# Altium schematic sheet Sheet1.SchDoc
size A2
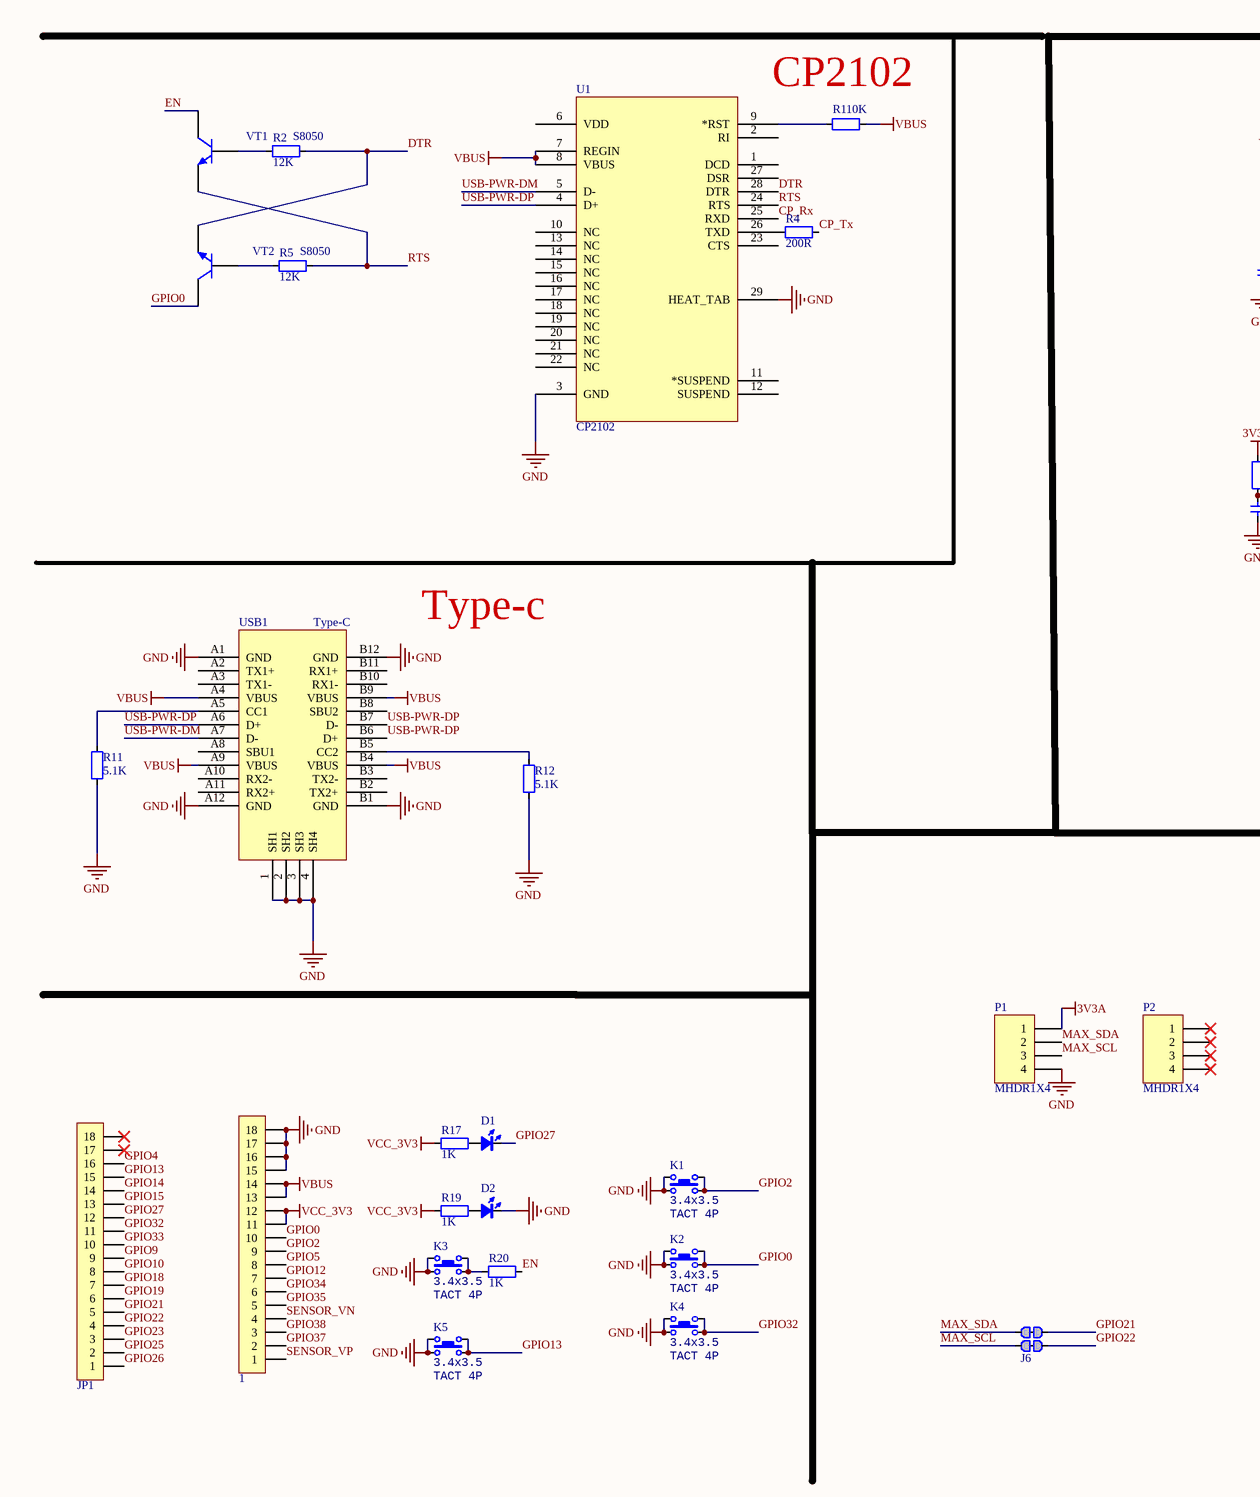
[diagram p0: Sheet1.SchDoc, left]
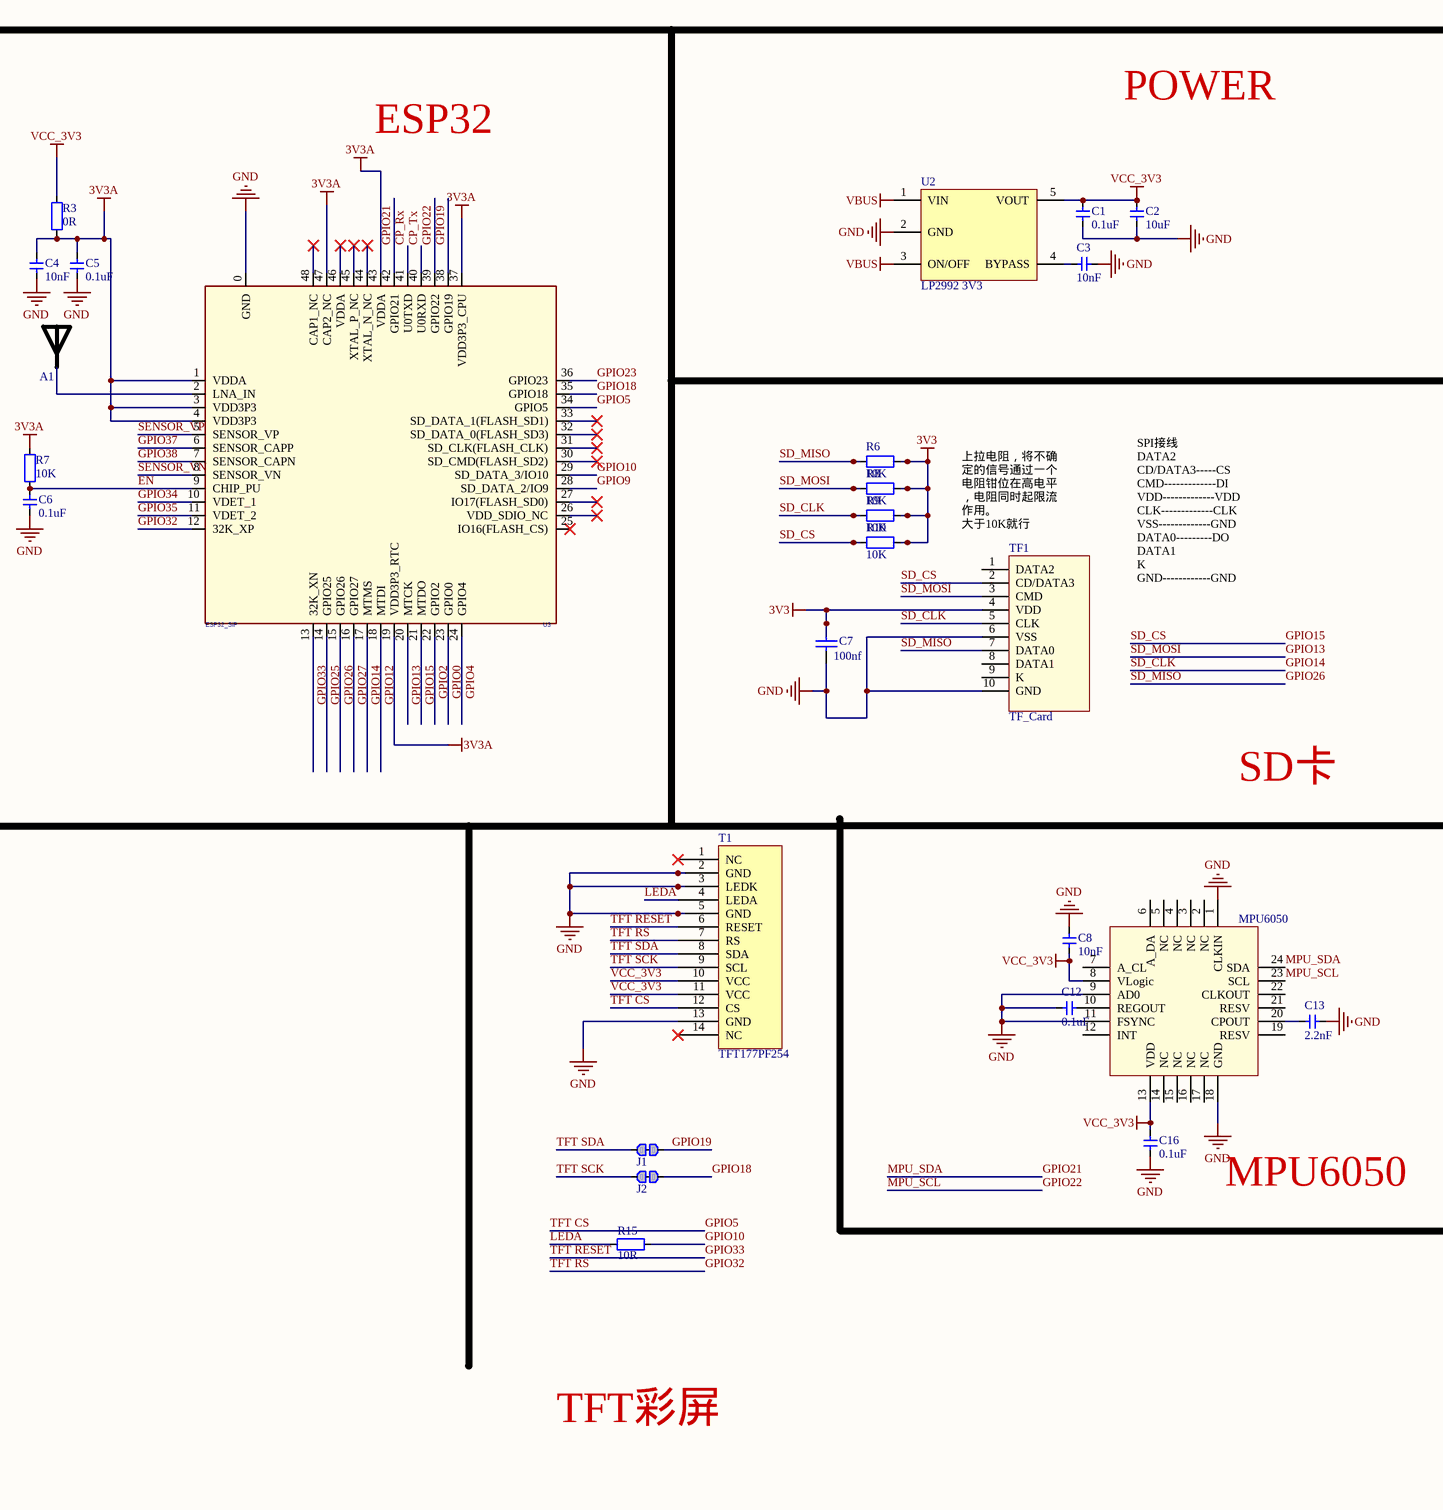
[diagram p1: Sheet1.SchDoc, right]

## Parts
1  HDR-1X18  [HDR2.54-LI-18P]  (value not drawn)
A1  RAINSUN  [ANT-Rainsun-AN5120]  (value not drawn)
C1  0.1uF  [CAP_0402]
C2  10uF  [CAP_0402]
C3  10nF  [CAP_0402]
C4  10nF  [CAP_0402]
C5  0.1uF  [CAP_0402]
C6  0.1uF  [CAP_0402]
C7  100nf  [CAP_0402]
C8  10nF  [CAP_0402]
C12  0.1uF  [CAP_0402]
C13  2.2nF  [CAP_0402]
C16  0.1uF  [CAP_0402]
D1  color?  [LED_0402_RED]  (value not drawn)
D2  color?  [LED_0402_RED]  (value not drawn)
J1  跳线  [0402-0R]  (value not drawn)
J2  跳线  [0402-0R]  (value not drawn)
J5  跳线  [0402-0R]  (value not drawn)
J6  跳线  [0402-0R]  (value not drawn)
JP1  HDR-1X18  [HDR2.54-LI-18P]  (value not drawn)
K1  value 3.4x3.5  [ButtonTACT_3.5*3.55_90]  (hidden comment: TACT 4P)
K2  value 3.4x3.5  [ButtonTACT_3.5*3.55_90]  (hidden comment: TACT 4P)
K3  value 3.4x3.5  [SW-SMD_4P-L4.2-W3.3-P2.15-LS5.1 - duplicate]  (hidden comment: TACT 4P)
K4  value 3.4x3.5  [ButtonTACT_3.5*3.55_90]  (hidden comment: TACT 4P)
K5  value 3.4x3.5  [SW-SMD_4P-L4.2-W3.3-P2.15-LS5.1 - duplicate]  (hidden comment: TACT 4P)
P1  MHDR1X4  [金手指4]
P2  MHDR1X4  [金手指4]
R1  10K  [R0402_L]
R2  12K  [R0402_L]
R3  0R  [R0402_L]
R4  200R  [R0402_L]
R5  12K  [R0402_L]
R6  10K  [R0402_L]
R7  10K  [R0402_L]
R8  10K  [R0402_L]
R9  10K  [R0402_L]
R10  10K  [R0402_L]
R11  5.1K  [R0402_L]
R12  5.1K  [R0402_L]
R15  10R  [R0402_L]
R17  1K  [R0402_L]
R19  1K  [R0402_L]
R20  1K  [R0402_L]
T1  TFT177PF254  [TFT144PF254]
TF1  TF_Card  [Micro SD]
U1  CP2102  [QFN-28]
U2  LP2992 3V3  [SOT23-5]
U3  ESP32_SIP  [QFN-48_7X7]
U4  MPU6050  [QFN-24]
USB1  Type-C  [Type-C-TOP]
VT1  S8050  [SMT_TRIODE_NPN]
VT2  S8050  [SMT_TRIODE_NPN]

## Nets
3V3: C7.2 R6.2 R8.2 R9.2 R10.2 TF1.4(VDD)
3V3A: C4.2 C5.2 P1.1 R3.1 R7.2 U3.1(VDDA) U3.3(VDD3P3) U3.4(VDD3P3) U3.19(VDD3P3_RTC) U3.37(VDD3P3_CPU) U3.43(VDDA) U3.47(CAP2_NC)
GND: 1.15 1.16 1.17 1.18 C1.1 C2.1 C3.1 C4.1 C5.1 C6.1 C7.1 C8.2 C12.2 C13.1 C16.1 D2.2(K) K1.1 K1.3 K2.1 K2.3 K3.1 K3.3 K4.1 K4.3 K5.1 K5.3 P1.4 R11.2 R12.2 T1.2(GND) T1.3(LEDK) T1.5(GND) T1.13(GND) TF1.6(VSS) TF1.10(GND) U1.3(GND) U1.29(HEAT_TAB) U2.2(GND) U3.0(GND) U4.1(CLKIN) U4.9(AD0) U4.11(FSYNC) U4.18(GND) USB1.1(SH1) USB1.2(SH2) USB1.3(SH3) USB1.4(SH4) USB1.A1(GND) USB1.A12(GND) USB1.B1(GND) USB1.B12(GND)
VBUS: 1.13 1.14 R1.2 U1.7(REGIN) U1.8(VBUS) U2.1(VIN) U2.3(ON/OFF) USB1.A4(VBUS) USB1.A9(VBUS) USB1.B4(VBUS) USB1.B9(VBUS)
VCC_3V3: 1.11 1.12 C1.2 C2.2 C8.1 C16.2 R3.2 R17.1 R19.1 T1.10(VCC) T1.11(VCC) U2.5(VOUT) U4.8(VLogic) U4.13(VDD)
CP_Rx: U1.25(RXD) U3.41(U0TXD)
CP_Tx: R4.2 U3.40(U0RXD)
DTR: R2.2 U1.28(DTR) VT2.2(E)
EN: C6.2 R7.1 R20.2 U3.9(CHIP_PU) VT1.3(C)
GPIO0: 1.10 K2.2 K2.4 U3.23(GPIO0) VT2.3(C)
GPIO2: 1.9 K1.2 K1.4 U3.22(GPIO2)
GPIO4: JP1.16 U3.24(GPIO4)
GPIO5: 1.8 T1.12(CS) U3.34(GPIO5)  [also labelled TFT CS]
GPIO9: JP1.9 U3.28(SD_DATA_2/IO9)
GPIO10: JP1.8 R15.2 U3.29(SD_DATA_3/IO10)
GPIO12: 1.7 U3.18(MTDI)
GPIO13: JP1.15 K5.2 K5.4 R8.1 TF1.3(CMD) U3.20(MTCK)  [also labelled SD_MOSI]
GPIO14: JP1.14 R9.1 TF1.5(CLK) U3.17(MTMS)  [also labelled SD_CLK]
GPIO15: JP1.13 R10.1 TF1.2(CD/DATA3) U3.21(MTDO)  [also labelled SD_CS]
GPIO18: J2.2 JP1.7 U3.35(GPIO18)
GPIO19: J1.2 JP1.6 U3.38(GPIO19)
GPIO21: J5.2 JP1.5 U3.42(GPIO21) U4.24(SDA)  [also labelled MPU_SDA]
GPIO22: J6.2 JP1.4 U3.39(GPIO22) U4.23(SCL)  [also labelled MPU_SCL]
GPIO23: JP1.3 U3.36(GPIO23)
GPIO25: JP1.2 U3.14(GPIO25)
GPIO26: JP1.1 R6.1 TF1.7(DATA0) U3.15(GPIO26)  [also labelled SD_MISO]
GPIO27: D1.2(K) JP1.12 U3.16(GPIO27)
GPIO32: JP1.11 K4.2 K4.4 T1.7(RS) U3.12(32K_XP)  [also labelled TFT RS]
GPIO33: JP1.10 T1.6(RESET) U3.13(32K_XN)  [also labelled TFT RESET]
GPIO34: 1.6 U3.10(VDET_1)
GPIO35: 1.5 U3.11(VDET_2)
GPIO37: 1.2 U3.6(SENSOR_CAPP)
GPIO38: 1.3 U3.7(SENSOR_CAPN)
LEDA: R15.1 T1.4(LEDA)
MAX_SCL: J6.1 P1.3
MAX_SDA: J5.1 P1.2
RTS: R5.2 U1.24(RTS) VT1.2(E)
SENSOR_VN: 1.4 U3.8(SENSOR_VN)
SENSOR_VP: 1.1 U3.5(SENSOR_VP)
TFT SCK: J2.1 T1.9(SCL)
TFT SDA: J1.1 T1.8(SDA)
USB-PWR-DM: U1.5(D-) USB1.A7(D-)
USB-PWR-DP: U1.4(D+) USB1.A6(D+) USB1.B6(D+) USB1.B7(D-)
NetA1_1: A1.1 U3.2(LNA_IN)
NetC3_2: C3.2 U2.4(BYPASS)
NetC12_1: C12.1 U4.10(REGOUT)
NetC13_2: C13.2 U4.20(CPOUT)
NetD1_1: D1.1(A) R17.2
NetD2_1: D2.1(A) R19.2
NetK3_2: K3.2 K3.4 R20.1
NetR1_1: R1.1 U1.9(*RST)
NetR2_1: R2.1 VT1.1(B)
NetR4_1: R4.1 U1.26(TXD)
NetR5_1: R5.1 VT2.1(B)
NetR11_1: R11.1 USB1.A5(CC1)
NetR12_1: R12.1 USB1.B5(CC2)

Not connected (* = marked no-connect by the designer): JP1 17* 18*; P2 1* 2* 3* 4*; T1 1(NC)* 14(NC)*; TF1 1(DATA2) 8(DATA1) 9(K); U1 1(DCD) 2(RI) 6(VDD) 10(NC) 11(*SUSPEND) 12(SUSPEND) 13(NC) 14(NC) 15(NC) 16(NC) 17(NC) 18(NC) 19(NC) 20(NC) 21(NC) 22(NC) 23(CTS) 27(DSR); U3 25(IO16(FLASH_CS))* 26(VDD_SDIO_NC)* 27(IO17(FLASH_SD0))* 30(SD_CMD(FLASH_SD2))* 31(SD_CLK(FLASH_CLK))* 32(SD_DATA_0(FLASH_SD3))* 33(SD_DATA_1(FLASH_SD1))* 44(XTAL_N_NC)* 45(XTAL_P_NC)* 46(VDDA)* 48(CAP1_NC)*; U4 2(NC) 3(NC) 4(NC) 5(NC) 6(A_DA) 7(A_CL) 12(INT) 14(NC) 15(NC) 16(NC) 17(NC) 19(RESV) 21(RESV) 22(CLKOUT); USB1 A2(TX1+) A3(TX1-) A8(SBU1) A10(RX2-) A11(RX2+) B2(TX2+) B3(TX2-) B8(SBU2) B10(RX1-) B11(RX1+)

## Notes on the sheet
- CP2102
- POWER
- ESP32
- (near TF1) 上拉电阻，将不确定的信号通过一个电阻钳位在高电平，电阻同时起限流作用。
  大于10K就行
- SPI接线
  DATA2
  CD/DATA3-----CS
  CMD-------------DI
  VDD-------------VDD
  CLK-------------CLK
  VSS-------------GND
  DATA0---------DO
  DATA1
  K
  GND------------GND
- Type-c
- SD卡
- MPU6050
- TFT彩屏

## Library data of the parts
1 JP1 = Header 18: 18P接插件; 封装库来自淘宝卖家 ID：黄晶宝石: 其他店铺购入均为盗版假冒封装库; 联系卖家，免费查找封装: 唯一出售店铺网址https://shop463601444.taobao.com; BOM名称: 18P接插件
A1 = ANT-Rainsun-AP5120
C1-C3 C8 C12 C13 C16 = 电容-0402: Capacitor; Value: 0.1u
C4 = 电容-0402_2: Capacitor; Value: 0.1u
C5 C6 = 电容-0402_1: Capacitor; Value: 0.1u
C7 = C: Capacitor; BOM名称: 无极性贴片电容; 联系卖家，免费查找封装: 唯一出售店铺网址https://shop463601444.taobao.com; 封装库来自淘宝卖家ID：黄晶宝石: 其他店铺购入均为盗版假冒封装库，请立即申请退款
D1 D2 = LED_0402: LED; Type: 0402; Value: color?
J1 J2 J5 J6 = 跳线: Resistor; Published: 8-Jun-2000; LatestRevisionDate: 17-Jul-2002; LatestRevisionNote: Re-released for DXP Platform.; PackageReference: AXIAL-0.4; Publisher: Altium Limited; PackageDescription: Axial Device, Thru-Hole; 2 Leads; 0.4 in Pin Spacing
K1-K5 = ButtonTACT: Button; type: TACT 4P
P1 P2 = MHDR1X4: Header, 4-Pin; LatestRevisionDate: 17-Jul-2002; LatestRevisionNote: Re-released for DXP Platform.; Publisher: Altium Limited
R1 R7 = 电阻-0402_1: Resistor; Value: 22R
R2 R5 R17 R19 R20 = 电阻-0402: Resistor; Value: 22R
R3 = 电阻-0402_3: Resistor; Value: 22R
R4 = 电阻-0402_2: Resistor; Value: 22R
R6 R8-R10 = R: 贴片电阻; 联系卖家，免费查找封装: 唯一出售店铺网址https://shop463601444.taobao.com; 封装库来自淘宝卖家ID：黄晶宝石: 其他店铺购入均为盗版假冒封装库，请立即申请退款; BOM名称: 贴片电阻
R11 R12 = 电阻-0402_7: Resistor; Value: 22R
R15 = 电阻-0402_9: Resistor
TF1 = TF_Card: TF卡座; 联系卖家，免费技术支持: 唯一出售店铺网址https://shop463601444.taobao.com; BOM名称: TF卡座
U1 = CP2102: USB转TTL; PART DESC: SINGLE-CHIP USB TO UART BRIDGE, QFN28, RoHS.; MFG #1: SILICON LABS; PART NUMBER: CP2102; Value: Value; RefDes: RefDes; Type: DEV
U2 = LP2992: LDO
U3 = ESP32-PICO
U4 = MPU6050: 六轴传感器
USB1 = USB-Type-C-TOP
VT1 VT2 = SMT_TRIODE_NPN: Surface mount NPN transistor, package SOT-23